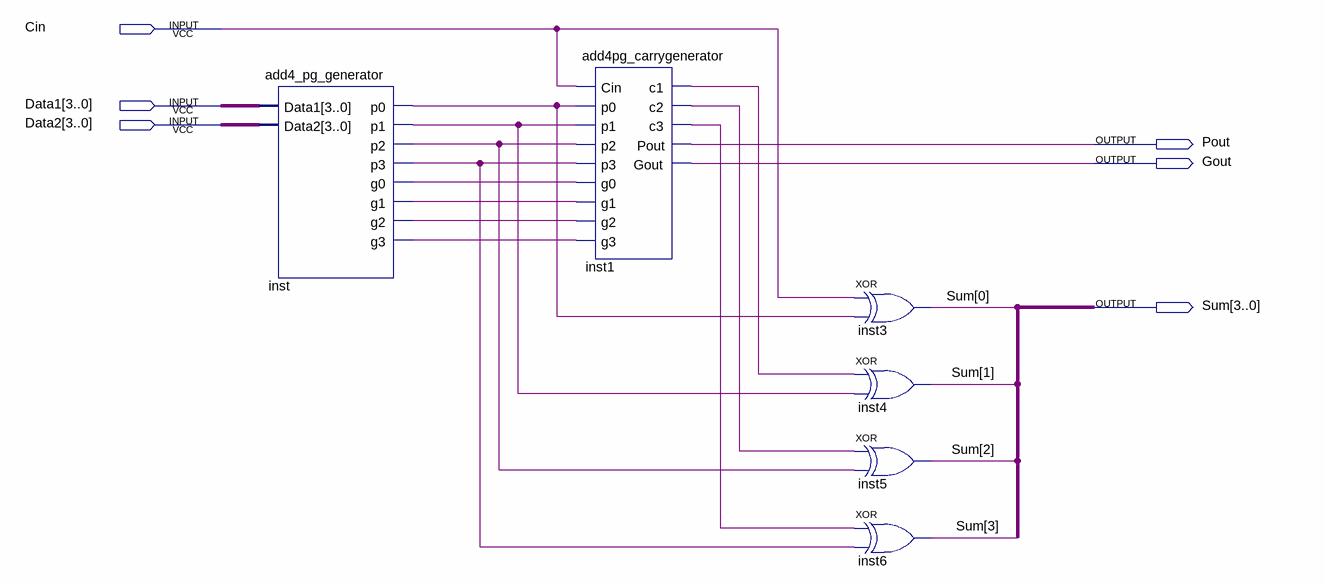
[diagram p0: schematic sheet]
// Quartus schematic add4pg.bdf as structural Verilog: 6 symbols, 6 pins
module add4pg (
  input  Cin,
  input  [3:0] Data1,
  input  [3:0] Data2,
  output Pout,
  output Gout,
  output [3:0] Sum
);

  wire inst1_c1, inst1_c2, inst1_c3, inst_g0, inst_g1, inst_g2, inst_g3, inst_p0, inst_p1, inst_p2, inst_p3;

  add4_pg_generator inst (
    .Data1(Data1), .Data2(Data2), .p0(inst_p0), .p1(inst_p1), .p2(inst_p2), .p3(inst_p3), .g0(inst_g0),
    .g1(inst_g1), .g2(inst_g2), .g3(inst_g3));
  add4pg_carrygenerator inst1 (
    .Cin(Cin), .p0(inst_p0), .p1(inst_p1), .p2(inst_p2), .p3(inst_p3), .g0(inst_g0), .g1(inst_g1),
    .g2(inst_g2), .g3(inst_g3), .c1(inst1_c1), .c2(inst1_c2), .c3(inst1_c3), .Pout(Pout), .Gout(Gout));
  xor inst3 (Sum[0], Cin, inst_p0);
  xor inst4 (Sum[1], inst1_c1, inst_p1);
  xor inst5 (Sum[2], inst1_c2, inst_p2);
  xor inst6 (Sum[3], inst1_c3, inst_p3);
endmodule
